# Altium schematic sheet Interface_Voltage_Sensor_1.SchDoc
size A3; SPICEModelCacheHXNSQRAW: <root> / <DocumentId>HXNSQRAW</DocumentId> / <CacheFrame Number="0"> / <Model Name="npn" Kind="MDL"> / <Text>*Default NPN BJT / *NPN Trans Pinout: C,B,E / .MODEL NPN NPN()</Text> / </Model> / </CacheFrame> / </root>
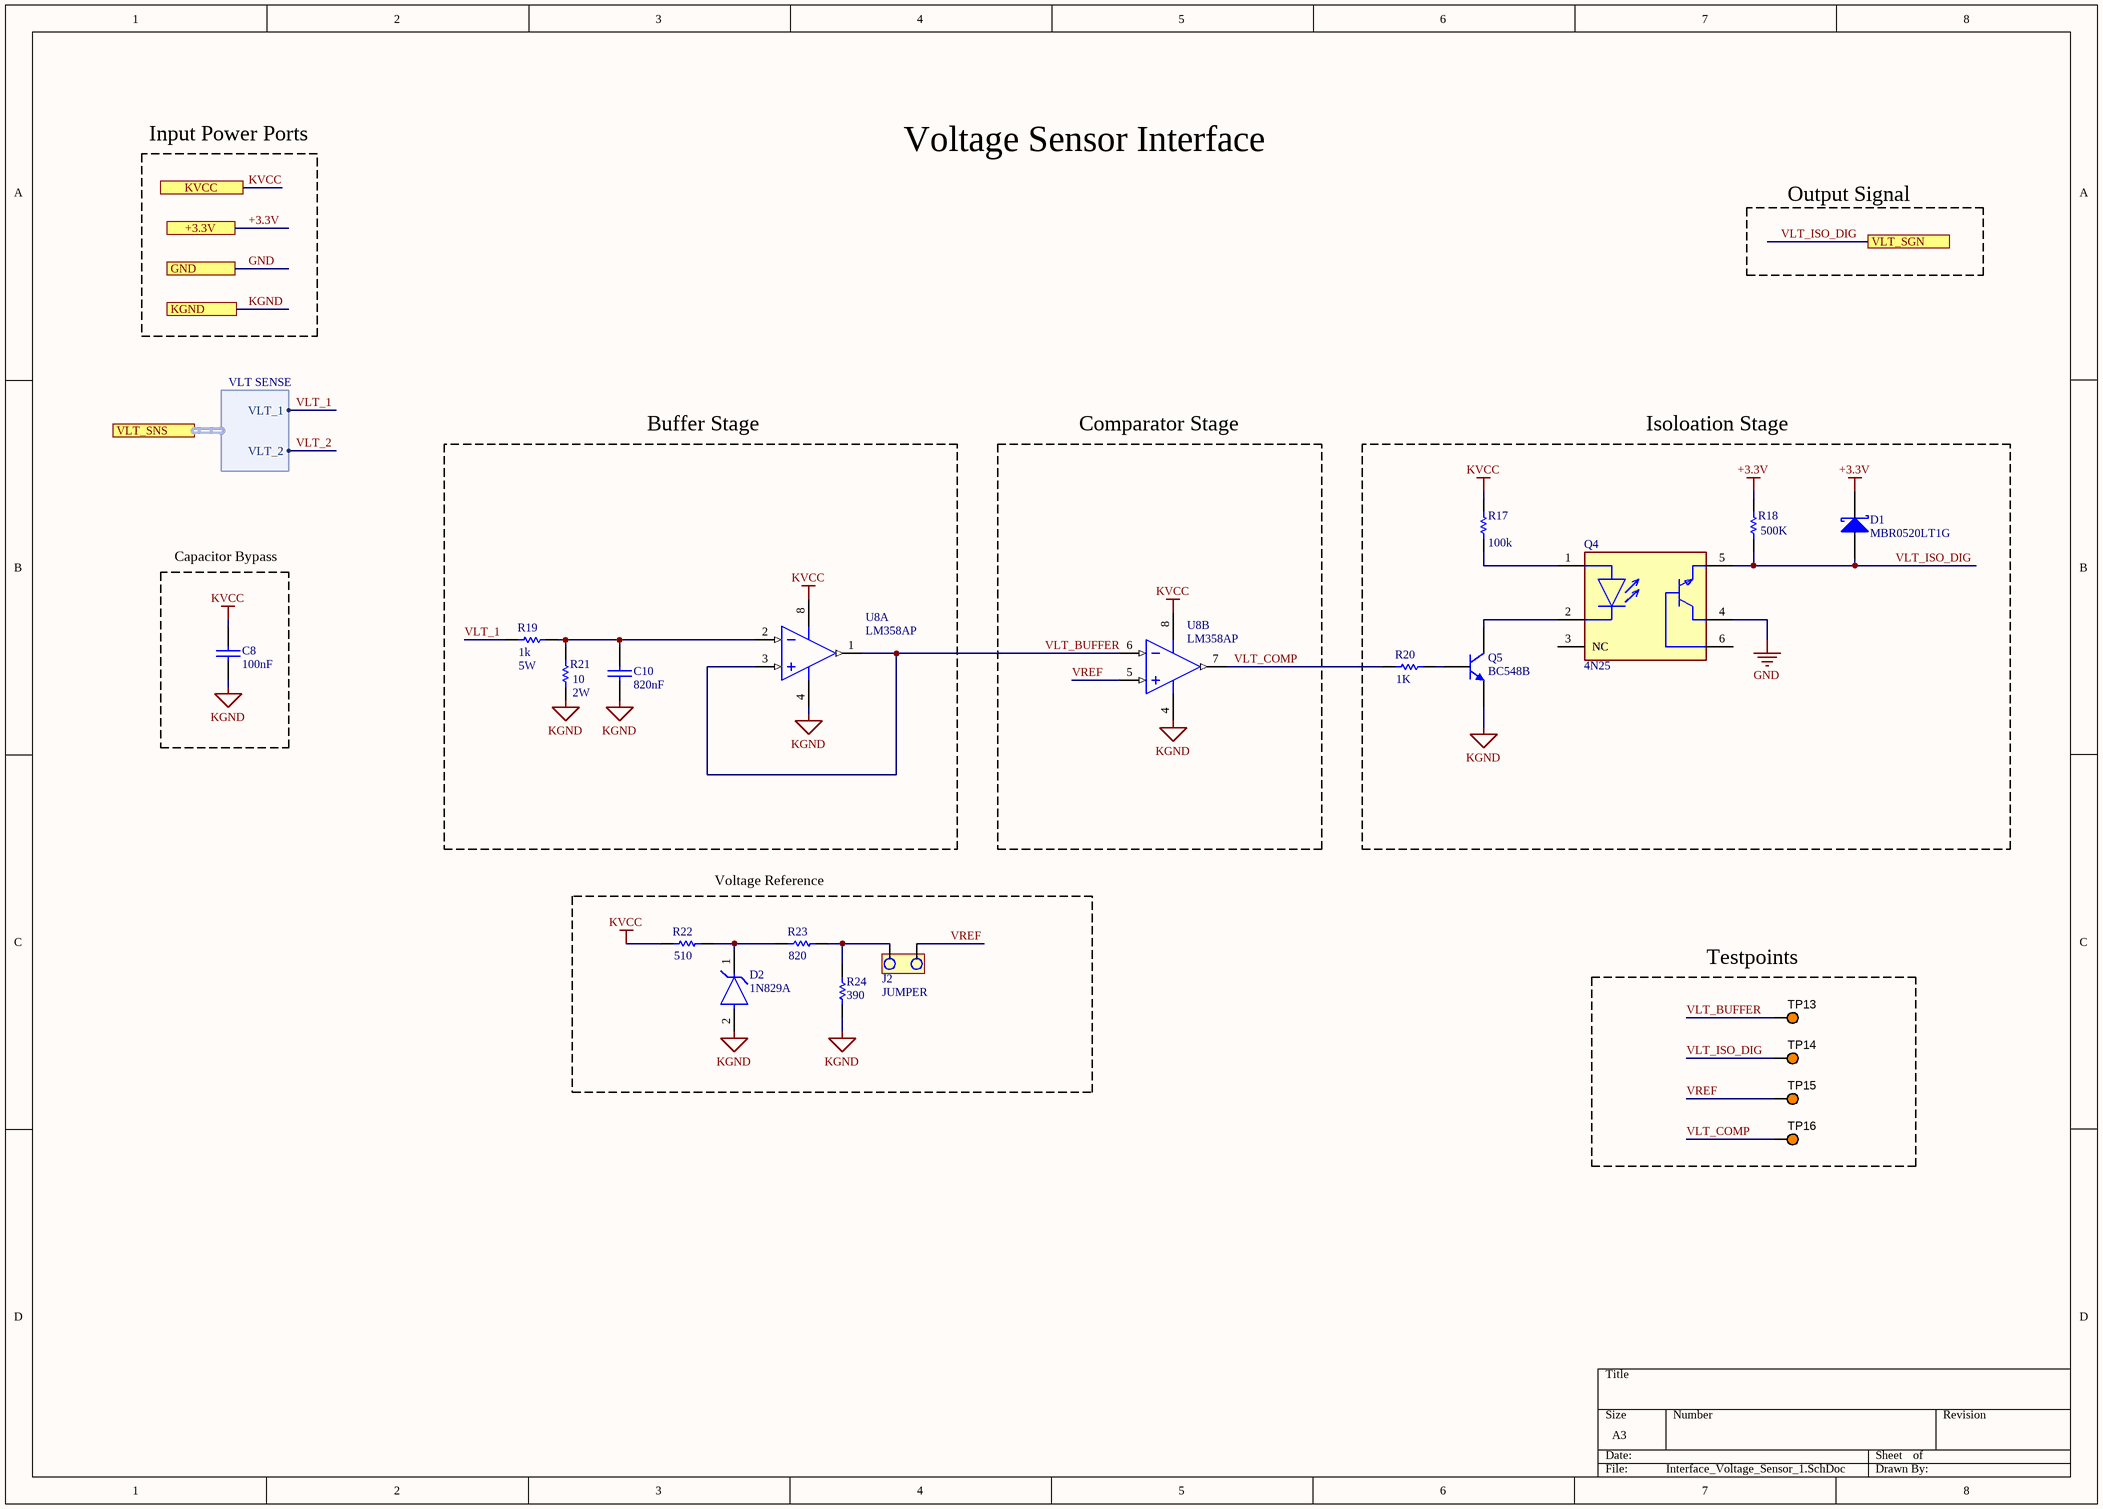
[diagram p0: Interface_Voltage_Sensor_1.SchDoc]

## Parts
C8  100nF  [CAP200]
C10  820nF  [CAP200]
D1  MBR0520LT1G  [ONSC-SOD-123-2-425-04_V]
D2  1N829A  [FP-DO-35-MFG]
J2  JUMPER  [JUMPER2]
Q4  4N25  [FP-4N25-MFG]
Q5  BC548B  [TO-226-AA]
R17  value 100k  [AXIAL-0.3]  (hidden comment: Res1)
R18  value 500K  [AXIAL-0.3]  (hidden comment: Res1)
R19  5W  value 1k  [AXIAL-0.3]
R20  value 1K  [AXIAL-0.3]  (hidden comment: Res1)
R21  2W  value 10  [AXIAL-0.3]
R22  value 510  [AXIAL-0.3]  (hidden comment: Res1)
R23  value 820  [AXIAL-0.3]  (hidden comment: Res1)
R24  value 390  [AXIAL-0.3]  (hidden comment: Res1)
TP13  5003  [KSTN-5003]  (value not drawn)
TP14  5003  [KSTN-5003]  (value not drawn)
TP15  5003  [KSTN-5003]  (value not drawn)
TP16  5003  [KSTN-5003]  (value not drawn)
U8  LM358AP  [P0008A]  (parts A,B of 2)

## Blocks framed on the sheet
Buffer Stage: C10 R19 R21 U8
Comparator Stage: U8
Isoloation Stage: D1 Q4 Q5 R17 R18 R20
Capacitor Bypass: C8
Voltage Reference: D2 J2 R22-R24
Testpoints: TP13-TP16

## Ports
+3.3V, GND, KGND, KVCC, VLT_SGN, VLT_SNS (harness vlt sense)

## Harnesses
VLT SENSE: VLT_2, VLT_1

## Nets
+3.3V: D1.2(K) R18.2 ; port +3.3V
GND: Q4.4(E) ; port GND
KGND: C8.2 C10.2 D2.2(A) Q5.3(E) R21.1 R24.1 U8.4(GND) ; port KGND
KVCC: C8.1 R17.2 R22.1 U8.8(VCC) ; port KVCC
VLT_1: R19.1 ; port VLT_SNS.VLT_1
VLT_2: port VLT_SNS.VLT_2
VLT_BUFFER: TP13.1 U8.1(1OUT) U8.3(1IN+) U8.6(2IN-)
VLT_COMP: R20.1 TP16.1 U8.7(2OUT)
VLT_ISO_DIG: D1.1(A) Q4.5(C) R18.1 TP14.1 ; port VLT_SGN
VREF: J2.2 TP15.1 U8.5(2IN+)
NetC10_1: C10.1 R19.2 R21.2 U8.2(1IN-)
NetD2_1: D2.1(C) R22.2 R23.1
NetJ2_1: J2.1 R23.2 R24.2
NetQ4_1: Q4.1(A) R17.1
NetQ4_2: Q4.2(C) Q5.1(C)
NetQ5_2: Q5.2(B) R20.2

Not connected (* = marked no-connect by the designer): Q4 3(NC) 6(B)

## Buses and harness runs
harness  = port VLT_SNS

## Notes on the sheet
- Input Power Ports
- Voltage Sensor Interface
- Output Signal

## Library data of the parts
C8 C10 = CAP
D1 = CMP-004-00003-2: Schottky Power Rectifier, 20 V, 5.5 A, -65 to 125 degC, 2-Pin SMD, RoHS, Tape and Reel; Manufacturer: ON Semiconductor; Forward Current: 500mA; Peak Reverse Current: 250uA; Elements: 1; Forward Voltage: 385mV; Max Surge Current: 5.5A; Max Operating Temperature: 125°C; Min Operating Temperature: -65°C; Mounting Technology: SM; Datasheet URL: http://www.onsemi.cn/pub_link/Collateral/MBR0520LT1-D.PDF; RoHS Compliant: True; Pins: 2; Package Quantity: 3000; Case/Package: SOD; Package Reference: SOD-123-2-425-04; Package Description: 2-Pin Surface Mount Device, Body 2.69 x 1.6 mm; Packaging: TapeandReel; Manufacturer URL: http://www.onsemi.com/; Datasheet Version: Rev. 6, 01/2012
D2 = CMP-004-00078-1: Zener Diode, 6.2V V(Z), 4.84%, 0.5W, Silicon, DO-204AA
Q4 = CMP-00026-00001-1: VISHAY 4N25 Transistor Output Optocoupler, 1 Channel, DIP, 6 Pins, 60 mA, 5 kV, 20 %
Q5 = NPN: NPN Bipolar Transistor; Published: 8-Jun-2000; LatestRevisionDate: 17-Jul-2002; LatestRevisionNote: Re-released for DXP Platform.; PackageReference: TO-226-AA; Publisher: Altium Limited; PackageDescription: TO, Flat Index; 3 In-Line, Axial Leads; Body Dia. 4.8mm; Leads 0.55 x 0.51 mm (max); Code_JEDEC: TO-226-AA
R17-R24 = Res1: Resistor; Published: 8-Jun-2000; LatestRevisionDate: 17-Jul-2002; LatestRevisionNote: Re-released for DXP Platform.; PackageReference: AXIAL-0.3; Publisher: Altium Limited; PackageDescription: Axial Device, Thru-Hole; 2 Leads; 0.3 in Pin Spacing
TP13-TP16 = CMP-002-00037-2: Test Point, Orange, Height 4.6 mm, Tail Length 3 mm, 1-Pin THD, RoHS; Manufacturer: Keystone; Colour: Orange; Packaging: Bulk; Package Description: 1-Pin Through Hole Device, Dia 2.54 mm; Pins: 1; Package Reference: 5003; Datasheet Version: Jun-15; Case/Package: 5003; Mounting Technology: TH; Connector Type: TestPoint; Diameter: 2.54mm; Contact Material: Bronze; Datasheet URL: http://keyelco.com/userAssets/file/M65p56.pdf; Manufacturer URL: http://www.keyelco.com/; Package Quantity: 10; Contact Plating: Tin; RoHS Compliant: True
U8 = CMP-014-00023-2: Dual Operational Amplifier, 3 to 32 V, 0 to 70 degC, 8-Pin PDIP (P), Pb-Free (RoHS), Tube; Manufacturer: Texas Instruments (TI); Channels: 2; Max Dual Supply Voltage: 16V; Min Dual Supply Voltage: 1.5V; Slew Rate: 0.3V/us; Unity Gain Bandwidth Product: 700KHz; Common Mode Rejection Ratio: 65dB; Nominal Supply Voltage: 5V; Package Version: 4040082/E, 04/2010; Output Current: 30mA; Nominal Supply Current: 1.2mA; Nominal Voltage Gain: 100dB; Case/Package: DIP; Max Operating Temperature: 70°C; RoHS Compliant: True; Manufacturer URL: http://www.ti.com/; Pins: 8; Package Description: 8-Pin Double In-line Package, Body 9.59 x 6.35 mm, Pitch 2.54 mm; Datasheet URL: http://www.ti.com/lit/ds/symlink/lm358a.pdf; Max Supply Voltage: 16V; Package Reference: P0008A; Mounting Technology: TH; Min Operating Temperature: 0°C; Package URL: http://www.ti.com/lit/ml/mpdi001b/mpdi001b.pdf; Min Supply Voltage: 1.5V; Package Quantity: 50; Packaging: Rail/Tube; Datasheet Version: SLOS068T, 04/2015; Nominal Gain Bandwith Product: 700KHz